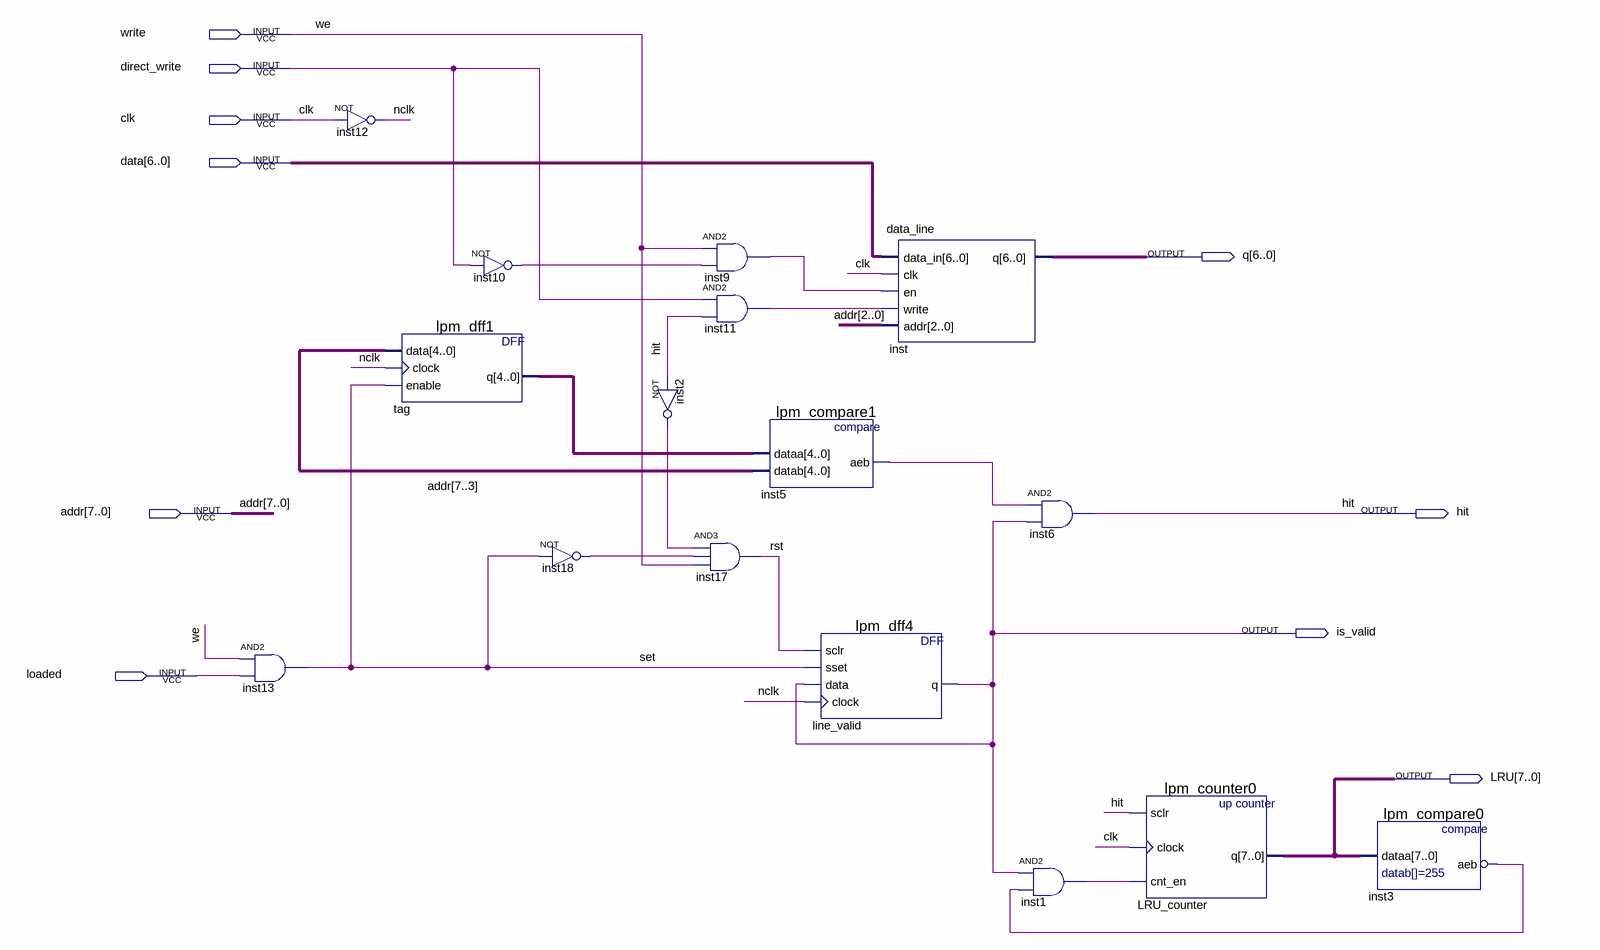
[diagram p0: schematic sheet]
// Quartus schematic cache_line.bdf as structural Verilog: 16 symbols, 10 pins
module cache_line (
  input  write,
  input  direct_write,
  input  clk,
  input  [6:0] data,
  input  [7:0] addr,
  input  loaded,
  output [6:0] q,
  output hit,
  output is_valid,
  output [7:0] LRU
);

  wire inst1_out, inst2_out, inst3_aeb, inst3_aeb_inverted_out, inst5_aeb, inst9_out, inst10_out, inst11_out,
       inst18_out, nclk, rst, set;
  wire [4:0] tag_q;

  and inst13 (set, write, loaded);
  not inst12 (nclk, clk);
  lpm_dff1 tag (.data(addr[7:3]), .clock(nclk), .enable(set), .q(tag_q));
  not inst10 (inst10_out, direct_write);
  not inst18 (inst18_out, set);
  and inst9 (inst9_out, write, inst10_out);
  and inst11 (inst11_out, direct_write, hit);
  not inst2 (inst2_out, hit);
  and inst17 (rst, inst2_out, inst18_out, write);
  lpm_compare1 inst5 (.dataa(tag_q), .datab(addr[7:3]), .aeb(inst5_aeb));
  lpm_dff4 line_valid (.sclr(rst), .sset(set), .data(is_valid), .clock(nclk), .q(is_valid));
  data_line inst (.data_in(data), .clk(clk), .en(inst9_out), .write(inst11_out), .addr(addr[2:0]), .q(q));
  and inst6 (hit, inst5_aeb, is_valid);
  and inst1 (inst1_out, is_valid, inst3_aeb_inverted_out);
  lpm_counter0 LRU_counter (.sclr(hit), .clock(clk), .cnt_en(inst1_out), .q(LRU));
  lpm_compare0 inst3 (.dataa(LRU), .aeb(inst3_aeb));
  not inst3_aeb_inverted (inst3_aeb_inverted_out, inst3_aeb);

  // Other names for the same wires on the sheet: we = write
endmodule
